# EAGLE design CoffretClimatique (EAGLE 6.4)
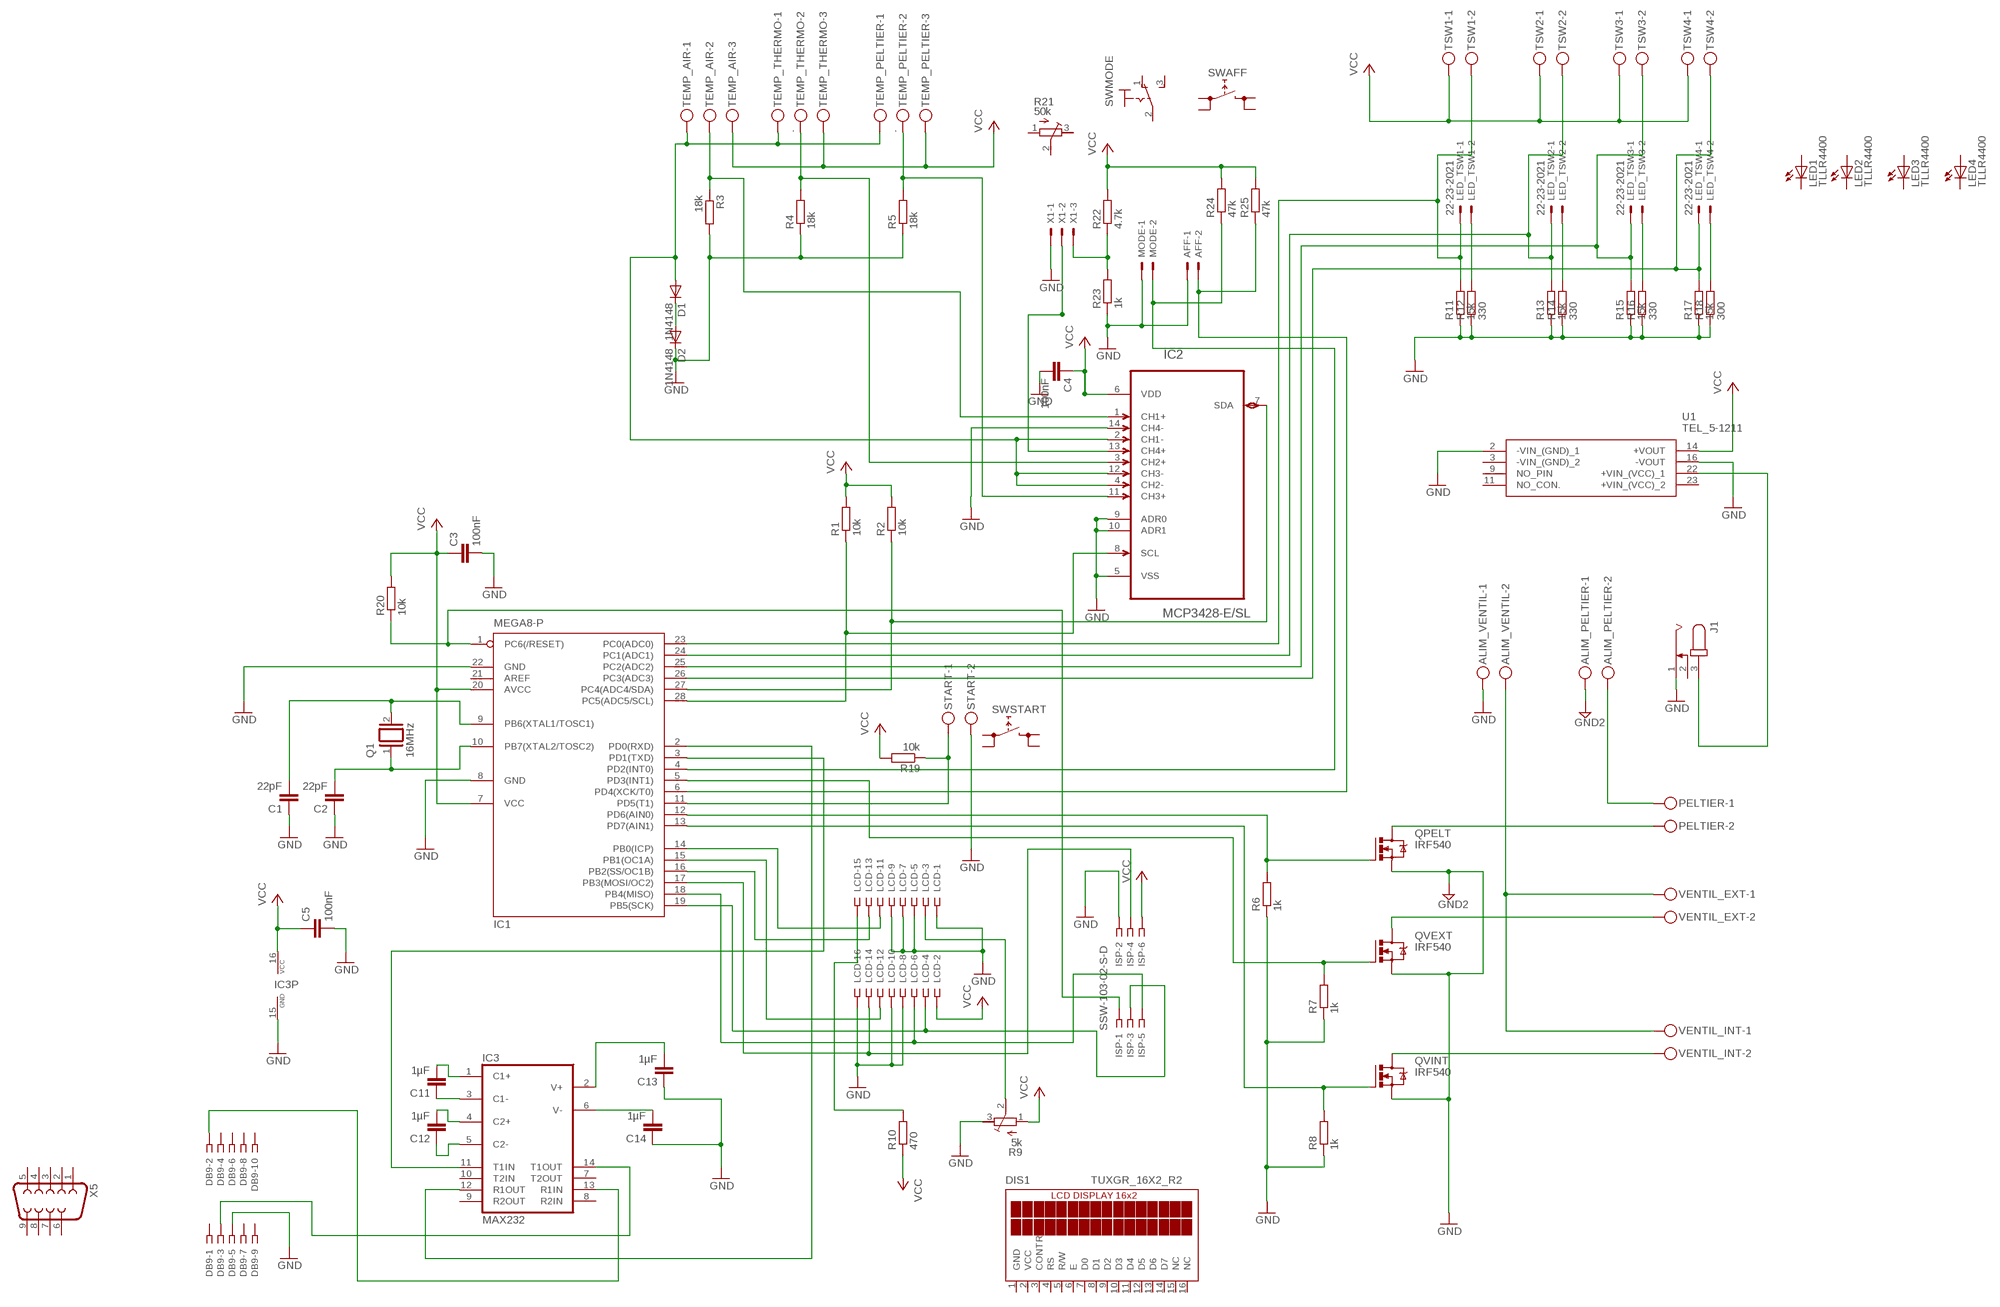
[diagram p0: schematic, sheet 1]

## Parts
AFF  22-23-2021  [22-23-2021]
ALIM_PELTIER  MKDSN1,5/2-5,08  [MKDSN1,5/2-5,08]
ALIM_VENTIL  MKDSN1,5/2-5,08  [MKDSN1,5/2-5,08]
C1  22pF  C-EU075-032X103  [C075-032X103]
C2  22pF  C-EU075-032X103  [C075-032X103]
C3  100nF  C-EUC1206  [C1206]
C4  100nF  C-EUC1206  [C1206]
C5  100nF  C-EUC1206  [C1206]
C11  1µF  C-EUC1206  [C1206]
C12  1µF  C-EUC1206  [C1206]
C13  1µF  C-EUC1206  [C1206]
C14  1µF  C-EUC1206  [C1206]
D1  1N4148  1N4148DO35-10  [DO35-10]
D2  1N4148  1N4148DO35-10  [DO35-10]
DB9  SSW-105-02-S-D  [SSW-105-02-S-D]
DIS1  TUXGR_16X2_R2  [TUXGR_16X2_R2]
IC1  MEGA8-P  [DIL28-3]
IC2  MCP3428-E/SL  [SOIC127P600X175-14N]
IC3  MAX232  [DIL16]
ISP  SSW-103-02-S-D  [SSW-103-02-S-D]
J1  JACK-PLUG1  [SPC4078]
LCD  SSW-108-02-S-D  [SSW-108-02-S-D]
LED1  TLLR4400  [LED3MM]
LED2  TLLR4400  [LED3MM]
LED3  TLLR4400  [LED3MM]
LED4  TLLR4400  [LED3MM]
LED_TSW1  22-23-2021  [22-23-2021]
LED_TSW2  22-23-2021  [22-23-2021]
LED_TSW3  22-23-2021  [22-23-2021]
LED_TSW4  22-23-2021  [22-23-2021]
MODE  22-23-2021  [22-23-2021]
PELTIER  MKDSN1,5/2-5,08  [MKDSN1,5/2-5,08]
Q1  16MHz  XTAL/S  [QS]
QPELT  IRF540  [TO220BV]
QVEXT  IRF540  [TO220BV]
QVINT  IRF540  [TO220BV]
R1  10k  R-EU_R0805  [R0805]
R2  10k  R-EU_R0805  [R0805]
R3  18k  R-EU_0207/10  [0207/10]
R4  18k  R-EU_0207/10  [0207/10]
R5  18k  R-EU_0207/10  [0207/10]
R6  1k  R-EU_0207/10  [0207/10]
R7  1k  R-EU_0207/10  [0207/10]
R8  1k  R-EU_0207/10  [0207/10]
R9  5k  R-TRIMM64P  [RTRIM64P]
R10  470  R-EU_0207/10  [0207/10]
R11  15k  R-EU_0207/10  [0207/10]
R12  330  R-EU_0207/10  [0207/10]
R13  15k  R-EU_0207/10  [0207/10]
R14  330  R-EU_0207/10  [0207/10]
R15  15k  R-EU_0207/10  [0207/10]
R16  330  R-EU_0207/10  [0207/10]
R17  15k  R-EU_0207/10  [0207/10]
R18  300  R-EU_0207/10  [0207/10]
R19  10k  R-EU_0207/10  [0207/10]
R20  10k  R-EU_0207/10  [0207/10]
R21  50k  R-TRIMM3296X  [RTRIM3296X]
R22  4.7k  R-EU_0207/10  [0207/10]
R23  1k  R-EU_0207/10  [0207/10]
R24  47k  R-EU_0207/10  [0207/10]
R25  47k  R-EU_0207/10  [0207/10]
START  MKDSN1,5/2-5,08  [MKDSN1,5/2-5,08]
SWAFF  REKN  [REKN]
SWMODE  M9040P  [M9040P]
SWSTART  REKN  [REKN]
TEMP_AIR  MKDSN1,5/3-5,08  [MKDSN1,5/3-5,08]
TEMP_PELTIER  .  MKDSN1,5/3-5,08  [MKDSN1,5/3-5,08]
TEMP_THERMO  .  MKDSN1,5/3-5,08  [MKDSN1,5/3-5,08]
TSW1  MKDSN1,5/2-5,08  [MKDSN1,5/2-5,08]
TSW2  MKDSN1,5/2-5,08  [MKDSN1,5/2-5,08]
TSW3  MKDSN1,5/2-5,08  [MKDSN1,5/2-5,08]
TSW4  MKDSN1,5/2-5,08  [MKDSN1,5/2-5,08]
U1  TEL_5-1211  [TEL-5-1211]
VENTIL_EXT  MKDSN1,5/2-5,08  [MKDSN1,5/2-5,08]
VENTIL_INT  MKDSN1,5/2-5,08  [MKDSN1,5/2-5,08]
X1  22-23-2031  [22-23-2031]
X5  F09V  [F09V]

## Nets
GND: AFF.1 ALIM_VENTIL.1 C1.1 C2.1 C3.2 C4.2 C5.2 C13.1 C14.1 D2.C DB9.5 IC1.8(GND) IC1.22(GND) IC2.5(VSS) IC2.9(ADR0) IC2.10(ADR1) IC2.14(CH4-) IC3.15(GND) ISP.2 J1.1 LCD.1 LCD.5 LCD.7 LCD.8 LCD.9 LCD.10 LCD.16 MODE.1 QPELT.S QVEXT.S QVINT.S R3.2 R4.1 R5.1 R6.1 R7.1 R8.1 R9.3(E) R11.1 R12.1 R13.1 R14.1 R15.1 R16.1 R17.1 R18.1 R23.1 START.2 U1.2(-VIN_(GND)_1) U1.16(-VOUT) X1.1 ; supply symbol labelled GND2
GND2 [PWR]: ALIM_PELTIER.1
N$1: C1.2 IC1.9(PB6(XTAL1/TOSC1)) Q1.2
N$2: C2.2 IC1.10(PB7(XTAL2/TOSC2)) Q1.1
N$3: J1.3 U1.22(+VIN_(VCC)_1)
N$4 [PWR]: QVEXT.D VENTIL_EXT.2
N$5: IC1.27(PC4(ADC4/SDA)) IC2.7(SDA) R2.1
N$6: IC1.28(PC5(ADC5/SCL)) IC2.8(SCL) R1.1
N$7: D1.C D2.A
N$8 [PWR]: ALIM_PELTIER.2 PELTIER.1
N$9: IC2.1(CH1+) R3.1 TEMP_AIR.2
N$10: IC2.3(CH2+) R4.2 TEMP_THERMO.2
N$11: IC2.11(CH3+) R5.2 TEMP_PELTIER.2
N$12: D1.A IC2.2(CH1-) IC2.4(CH2-) IC2.12(CH3-) TEMP_AIR.1 TEMP_PELTIER.1 TEMP_THERMO.1
N$13: IC2.13(CH4+) X1.2
N$14 [PWR]: PELTIER.2 QPELT.D
N$15: ALIM_VENTIL.2 VENTIL_EXT.1 VENTIL_INT.1
N$16: IC1.12(PD6(AIN0)) QPELT.G R6.2
N$17: IC1.5(PD3(INT1)) QVEXT.G R7.2
N$18: IC1.3(PD1(TXD)) IC3.11(T1IN)
N$19: QVINT.D VENTIL_INT.2
N$20: DB9.2 IC3.13(R1IN)
N$21: LCD.3 R9.2(S)
N$22: DB9.3 IC3.14(T1OUT)
N$23: LCD.15 R10.2
N$25: R22.1 R23.2 X1.3
N$30: IC1.4(PD2(INT0)) MODE.2 R24.1
N$31: AFF.2 IC1.6(PD4(XCK/T0)) R25.1
N$36: IC1.11(PD5(T1)) R19.1 START.1
N$37: IC1.2(PD0(RXD)) IC3.12(R1OUT)
N$38: IC1.13(PD7(AIN1)) QVINT.G R8.2
N$39: IC1.23(PC0(ADC0)) LED_TSW1.1 R11.2 TSW1.2
N$40: IC1.19(PB5(SCK)) ISP.3 LCD.4
N$41: IC1.24(PC1(ADC1)) LED_TSW2.1 R13.2 TSW2.2
N$42: IC1.18(PB4(MISO)) ISP.5 LCD.6
N$43: IC1.25(PC2(ADC2)) LED_TSW3.1 R15.2 TSW3.2
N$44: IC1.14(PB0(ICP)) LCD.11
N$45: IC1.26(PC3(ADC3)) LED_TSW4.1 R17.2 TSW4.2
N$46: IC1.15(PB1(OC1A)) LCD.12
N$47: IC1.16(PB2(SS/OC1B)) LCD.13
N$48: LED_TSW1.2 R12.2
N$49: LED_TSW2.2 R14.2
N$50: LED_TSW3.2 R16.2
N$51: LED_TSW4.2 R18.2
N$52: IC1.17(PB3(MOSI/OC2)) ISP.4 LCD.14
N$53: IC1.1(PC6(/RESET)) ISP.1 R20.1
N$54: C11.2 IC3.1(C1+)
N$55: C11.1 IC3.3(C1-)
N$56: C12.2 IC3.4(C2+)
N$57: C12.1 IC3.5(C2-)
N$58: C14.2 IC3.6(V-)
N$59: C13.2 IC3.2(V+)
VCC: C3.1 C4.1 C5.1 IC1.7(VCC) IC1.20(AVCC) IC2.6(VDD) IC3.16(VCC) ISP.6 LCD.2 R1.2 R2.2 R9.1(A) R10.1 R19.2 R20.2 R22.2 R24.2 R25.2 TEMP_AIR.3 TEMP_PELTIER.3 TEMP_THERMO.3 TSW1.1 TSW2.1 TSW3.1 TSW4.1 U1.14(+VOUT)
Unconnected: DB9.1 DB9.4 DB9.6 DB9.7 DB9.8 DB9.9 DB9.10 DIS1.3(CONTR) DIS1.4(RS) DIS1.5(R/W) DIS1.6(E) DIS1.7(D0) DIS1.8(D1) DIS1.9(D2) DIS1.10(D3) DIS1.11(D4) DIS1.12(D5) DIS1.13(D6) DIS1.14(D7) DIS1.15(NC) DIS1.16(NC) IC1.21(AREF) IC3.7(T2OUT) IC3.8(R2IN) IC3.9(R2OUT) IC3.10(T2IN) J1.2 LED1.A LED1.K(C) LED2.A LED2.K(C) LED3.A LED3.K(C) LED4.A LED4.K(C) R21.1(A) R21.2(S) R21.3(E) SWAFF.0A SWAFF.0B SWAFF.1A SWAFF.1B SWMODE.1(O) SWMODE.2(P) SWMODE.3(S) SWSTART.0A SWSTART.0B SWSTART.1A SWSTART.1B U1.3(-VIN_(GND)_2) U1.9(NO_PIN) U1.11(NO_CON.) U1.23(+VIN_(VCC)_2) X5.1 X5.2 X5.3 X5.4 X5.5 X5.6 X5.7 X5.8 X5.9

## Power pins joined to a net without a drawn wire
GND: DIS1.1(GND)
VCC: DIS1.2(VCC)

## Library data of the parts
AFF LED_TSW1-LED_TSW4 MODE = con-molex:22-23-2021: .100" (2.54mm) Center Header - 2 Pin; MF: MOLEX; MPN: 22-23-2021; OC_FARNELL: 1462926; OC_NEWARK: 25C3832
ALIM_PELTIER ALIM_VENTIL PELTIER START TSW1-TSW4 VENTIL_EXT VENTIL_INT = con-phoenix-508:MKDSN1,5/2-5,08: MKDSN 1,5/ 2-5,08 Printklemme Nennstrom: 13,5 A Nennspannung: 250 V Rastermaß: 5,08 mm Polzahl: 2 Anschlussart: Schraubanschluss Montage: Löten Anschlussrichtung Leiter/Platine: 0 ° Artikelnummer: 1729128 Source: http://eshop.phoenixcontact.com .. 1729128.pdf; MPN: MKDSN 1,5/2-5.08; OC_FARNELL: 1792903; OC_NEWARK: 30M2397
C1-C5 C11-C14 = rcl:C-EU: CAPACITOR, European symbol
D1 D2 = diode:1N4148: DIODE high speed (Philips)
DB9 = con-samtec:SSW-105-02-S-D: THROUGH-HOLE .025" SQ POST SOCKET Source: Samtec SSW.pdf; MPN: SSW-105-02-S-D; OC_FARNELL: unknown; OC_NEWARK: 11P9398
DIS1 = display-lcd:TUXGR_16X2_R2: Tuxgraphics LCD display 16x2 characters reflective, without background light Source: tuxgr_12x2_r2.pdf; OC_FARNELL: unknown; OC_NEWARK: unknown
IC1 = atmel:MEGA8-P: MICROCONTROLLER 8 Kbytes FLASH, 1 kbytes SRAM, 512 bytes EEPROM, USART, 4-channel 10 bit ADC, 2-channel 8 bit ADC Pin compatible with Atmega48, ATMega88, ATMega168 Source: avr.lbr; OC_FARNELL: unknown; OC_NEWARK: unknown
IC2 = Microchip_By_element14_Batch_1:MCP3428-E/SL: Analog-to-Digital Converter; MPN: MCP3428-E/SL; OC_FARNELL: 1825014; OC_NEWARK: 52R9962; PACKAGE: SOIC-14; SUPPLIER: Microchip
IC3 = maxim:MAX232: RS232 TRANSEIVER; MF: MAXIM; MPN: MAX232ACPE+; OC_FARNELL: 9723773; OC_NEWARK: 68K4544
ISP = con-samtec:SSW-103-02-S-D: THROUGH-HOLE .025" SQ POST SOCKET Source: Samtec SSW.pdf; MPN: SSW-103-02-S-D; OC_FARNELL: unknown; OC_NEWARK: 11P9365
J1 = con-jack:JACK-PLUG: DC POWER JACK Power Jack, DC, Right Angle, Through Hole, Rated 5A at 16VDC, PC Terminals Distributor: Farnell (www.Farnell.de) Drawing: 84N1161.pdf / 84N1162.pdf Manufacturer: SPC Technology (www.spctechnology.com) Type: SPC4077 / SPC 4078; OC_FARNELL: unknown; OC_NEWARK: unknown
LCD = con-samtec:SSW-108-02-S-D: THROUGH-HOLE .025" SQ POST SOCKET Source: Samtec SSW.pdf; MPN: SSW-108-02-S-D; OC_FARNELL: unknown; OC_NEWARK: 85K7646
LED1-LED4 = led:TLLR4400: Low Current (2mA) LED 3 mm Tinted Diffused Package color RED Source: Data sheet <http://www.farnell.com/datasheets/391100.pdf>; MF: VISHAY SEMICONDUCTOR; OC_FARNELL: 1612437
Q1 = special:XTAL/S: CRYSTAL
QPELT QVEXT QVINT = transistor-power:IRF540: HEXFET Power MOSFET
R1-R8 R10-R20 R22-R25 = rcl:R-EU_: RESISTOR, European symbol
R9 R21 = rcl:R-TRIMM: Trimm resistor
SWAFF SWSTART = switch:REKN: PUSH SWITCH ITT-Cannon-Cannon
SWMODE = switch:M9040P: TOGGLE SWITCH Marquardt
TEMP_AIR TEMP_PELTIER TEMP_THERMO = con-phoenix-508:MKDSN1,5/3-5,08: MKDSN 1,5/ 3-5,08 Printklemme Nennstrom: 13,5 A Nennspannung: 250 V Rastermaß: 5,08 mm Polzahl: 3 Anschlussart: Schraubanschluss Montage: Löten Anschlussrichtung Leiter/Platine: 0 ° Artikelnummer: 1729131 Source: http://eshop.phoenixcontact.com .. 1729131.pdf; MPN: SMKDSN1,5/3-5,08; OC_FARNELL: 1792904; OC_NEWARK: 70R0299
U1 = TEL_5-1211:TEL_5-1211: TEL5 DC-DC converter,9-18Vin 5V 5W TRACOPOWER Isolated DC-DC Converter, Vin 9 18 V dc, Vout 5V dc, I/O isolation 1500V dc Source: Datasheet <http://assets.tracopower.com/20170802134720/TEL5/documents/tel5-datasheet.pdf>; ALLIED_NUMBER: 70421183; ALLIED_PRICE-STOCK: https://www.alliedelec.com/tracopower-tel-5-1211/70421183/; DESCRIPTION: TEL5 DC-DC converter,9-18Vin 5V 5W TRACOPOWER Isolated DC-DC Converter, Vin 9 18 V dc, Vout 5V dc, I/O isolation 1500V dc; HEIGHT: mm; MANUFACTURER_NAME: Traco Power; MANUFACTURER_PART_NUMBER: TEL 5-1211; MOUSER_PART_NUMBER: 495-TEL-5-1211; MOUSER_PRICE-STOCK: https://www.mouser.com/Search/Refine.aspx?Keyword=495-TEL-5-1211; RS_PART_NUMBER: 4667051; RS_PRICE-STOCK: https://uk.rs-online.com/web/p/products/4667051
X1 = con-molex:22-23-2031: .100" (2.54mm) Center Header - 3 Pin; MF: MOLEX; MPN: 22-23-2031; OC_FARNELL: 1462950; OC_NEWARK: 30C0862
X5 = con-subd:F09: SUB-D; OC_FARNELL: unknown; OC_NEWARK: unknown

## Net classes
1 PWR: width 2 mm

## Board
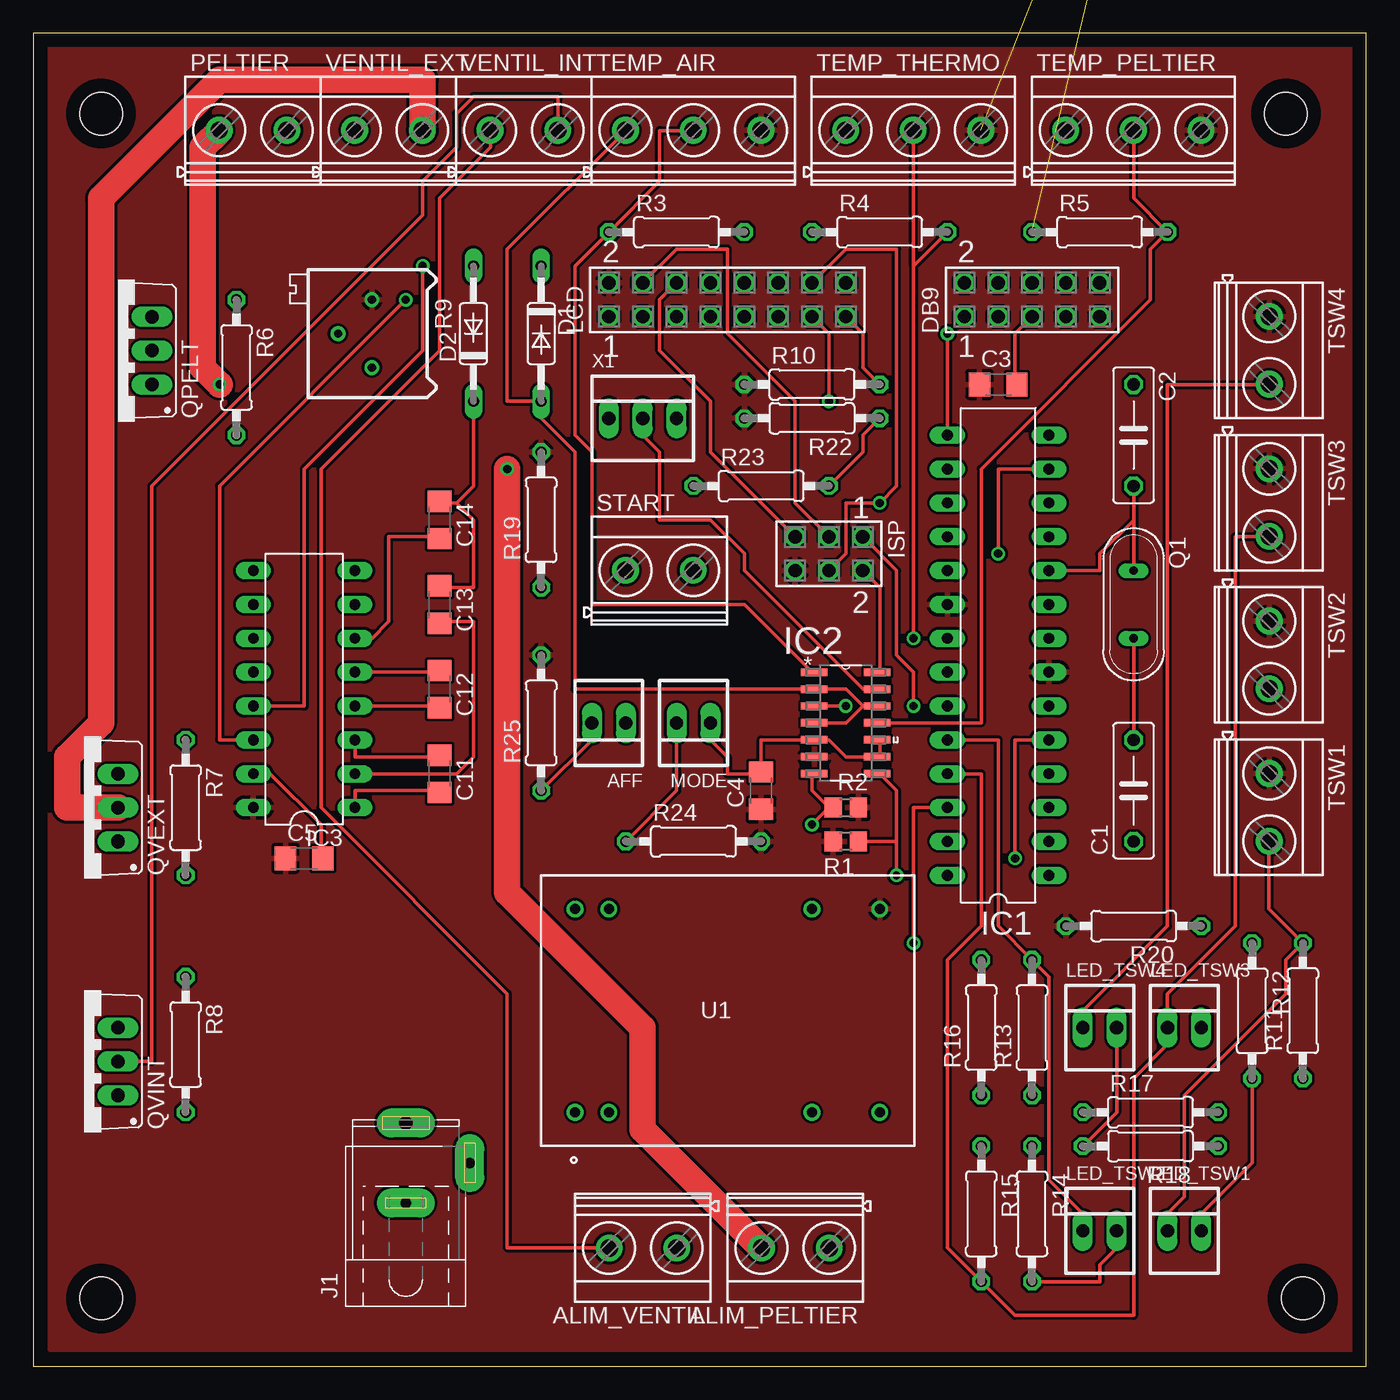
[diagram p1: board, top side]
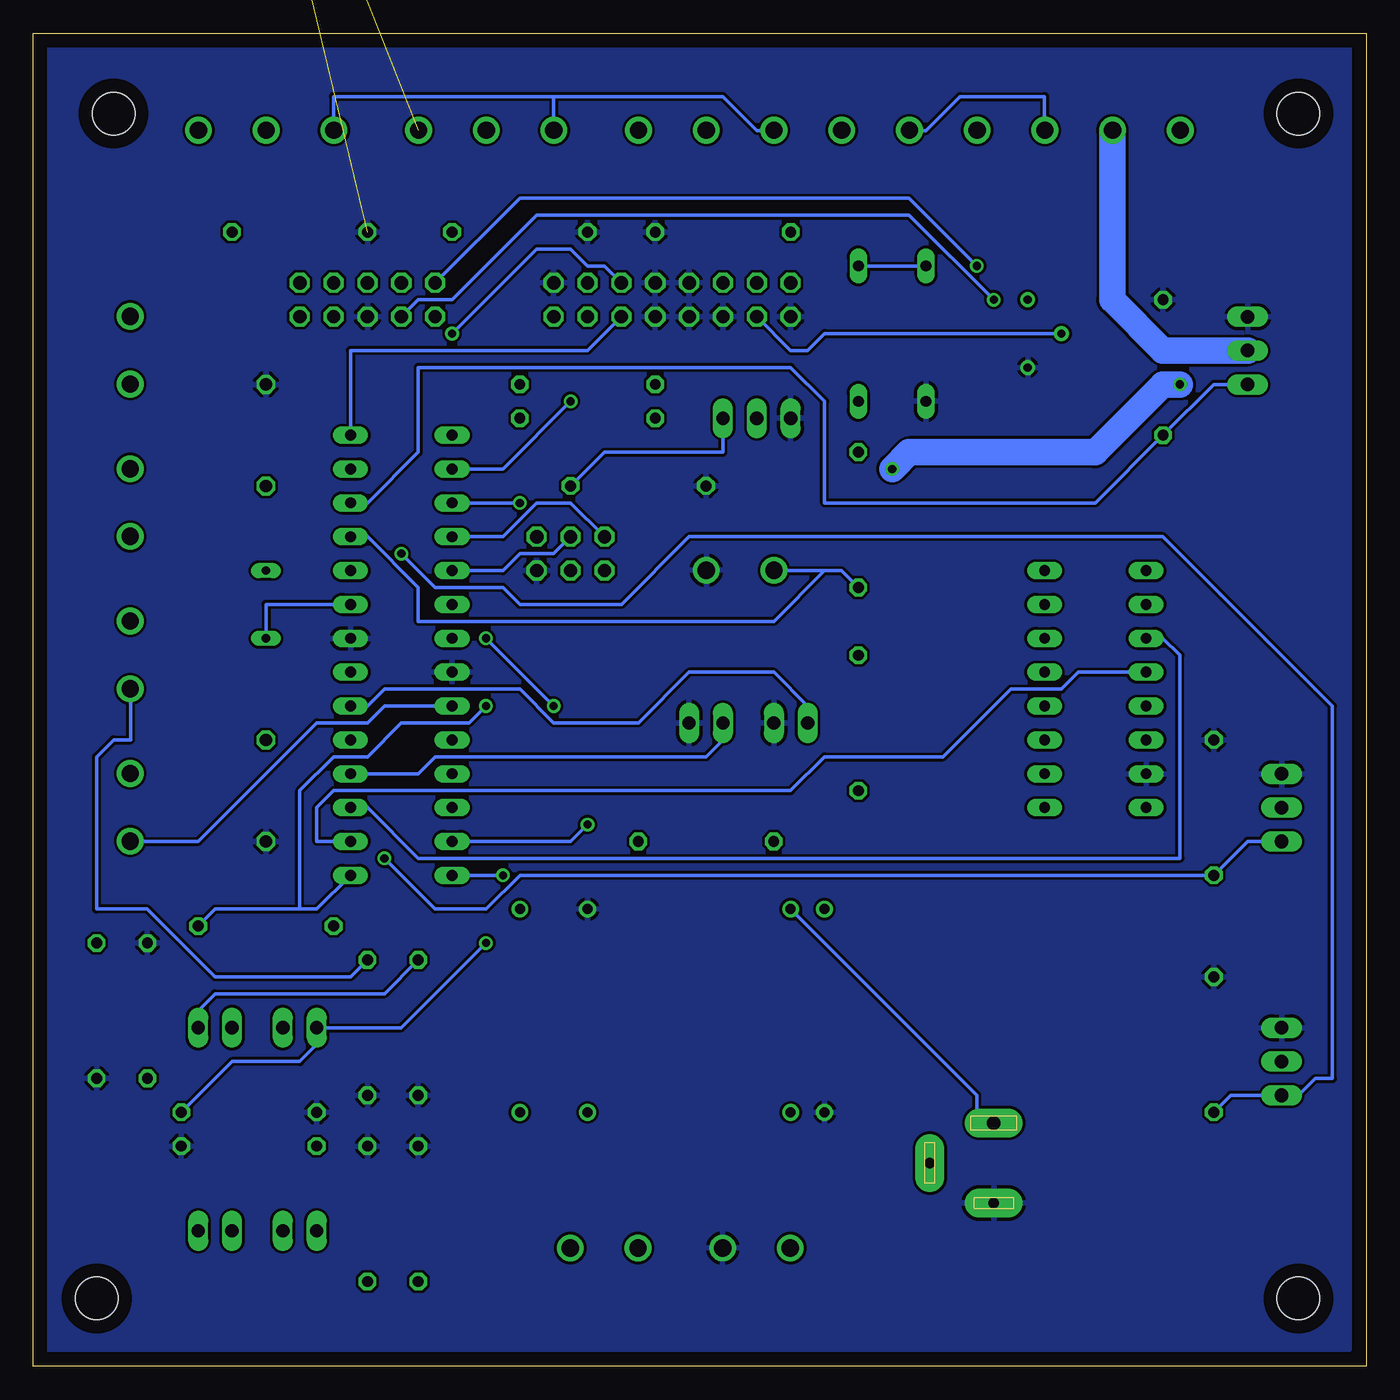
[diagram p2: board, bottom side, seen from below]

Size 100 x 100 mm. Coordinates in mm from the lower left corner, seen from the top.
Outline: 0,0 100,0 100,100 0,100 0,0
Copper layers (1*16): Top 0.035mm / dielectric 1.5mm / Bottom 0.035mm
Design rules "default": minimum track width 10mil, minimum drill 24mil, track to track 8mil, track to pad 8mil, pad to pad 8mil, via to via 8mil, smd to smd 8mil, copper to edge 40mil, drill to drill 8mil, minimum pad ring 10mil, minimum via ring 8mil, stop-mask expansion 4mil, vias tented up to drill 0mil, thermal gap 10mil
Holes 3.2 mm at 95.25,5.08 5.08,5.08 93.98,93.98 5.08,93.98

### Footprints (pad centres in the part's own frame; a part is rotated, then mirrored left to right if it is on the bottom)
22-23-2021 = drill 1 long: 1 -1.27,0; 2 1.27,0
MKDSN1,5/2-5,08 = drill 1.3 pad 2: 1 -2.561,0.025; 2 2.519,0.025
C075-032X103 = drill 0.914 octagon: 1 -3.81,0; 2 3.81,0
C1206 = smd 1.6 x 1.8: 1 -1.4,0; 2 1.4,0
DO35-10 = drill 0.813 long: A 5.08,0; C -5.08,0
SSW-105-02-S-D = drill 1 pad 1.5 octagon: 1 -5.08,-1.27; 2 -5.08,1.27; 3 -2.54,-1.27; 4 -2.54,1.27; 5 0,-1.27; 6 0,1.27; 7 2.54,-1.27; 8 2.54,1.27; 9 5.08,-1.27; 10 5.08,1.27
TUXGR_16X2_R2 = drill 1 pad 1.676: 1 -32,15.5; 2 -29.46,15.5; 3 -26.92,15.5; 4 -24.38,15.5; 5 -21.84,15.5; 6 -19.3,15.5; 7 -16.76,15.5; 8 -14.22,15.5; 9 -11.68,15.5; 10 -9.14,15.5; 11 -6.6,15.5; 12 -4.06,15.5; 13 -1.52,15.5; 14 1.02,15.5; 15 3.56,15.5; 16 6.1,15.5 | hole 2.5: -37.5,-15.5; 37.5,-15.5; -37.5,15.5; 37.5,15.5
DIL28-3 = drill 0.813 long: 1 -16.51,-3.81; 2 -13.97,-3.81; 3 -11.43,-3.81; 4 -8.89,-3.81; 5 -6.35,-3.81; 6 -3.81,-3.81; 7 -1.27,-3.81; 8 1.27,-3.81; 9 3.81,-3.81; 10 6.35,-3.81; 11 8.89,-3.81; 12 11.43,-3.81; 13 13.97,-3.81; 14 16.51,-3.81; 15 16.51,3.81; 16 13.97,3.81; 17 11.43,3.81; 18 8.89,3.81; 19 6.35,3.81; 20 3.81,3.81; 21 1.27,3.81; 22 -1.27,3.81; 23 -3.81,3.81; 24 -6.35,3.81; 25 -8.89,3.81; 26 -11.43,3.81; 27 -13.97,3.81; 28 -16.51,3.81
SOIC127P600X175-14N = smd 1.981 x 0.559: 1 -2.362,3.81; 2 -2.362,2.54; 3 -2.362,1.27; 4 -2.362,0; 5 -2.362,-1.27; 6 -2.362,-2.54; 7 -2.362,-3.81; 8 2.362,-3.81; 9 2.362,-2.54; 10 2.362,-1.27; 11 2.362,0; 12 2.362,1.27; 13 2.362,2.54; 14 2.362,3.81
DIL16 = drill 0.813 long: 1 -8.89,-3.81; 2 -6.35,-3.81; 3 -3.81,-3.81; 4 -1.27,-3.81; 5 1.27,-3.81; 6 3.81,-3.81; 7 6.35,-3.81; 8 8.89,-3.81; 9 8.89,3.81; 10 6.35,3.81; 11 3.81,3.81; 12 1.27,3.81; 13 -1.27,3.81; 14 -3.81,3.81; 15 -6.35,3.81; 16 -8.89,3.81
SSW-103-02-S-D = drill 1 pad 1.5 octagon: 1 -2.54,-1.27; 2 -2.54,1.27; 3 0,-1.27; 4 0,1.27; 5 2.54,-1.27; 6 2.54,1.27
SPC4078 = drill 0.8 pad 2.184 long: 1 -3,0; 2 0,-4.8 | drill 1 pad 2.184 long: 3 3,0
SSW-108-02-S-D = drill 1 pad 1.5 octagon: 1 -8.89,-1.27; 2 -8.89,1.27; 3 -6.35,-1.27; 4 -6.35,1.27; 5 -3.81,-1.27; 6 -3.81,1.27; 7 -1.27,-1.27; 8 -1.27,1.27; 9 1.27,-1.27; 10 1.27,1.27; 11 3.81,-1.27; 12 3.81,1.27; 13 6.35,-1.27; 14 6.35,1.27; 15 8.89,-1.27; 16 8.89,1.27
LED3MM = drill 0.813 octagon: A -1.27,0; K 1.27,0
QS = drill 0.61 long: 1 -2.54,0; 2 2.54,0
TO220BV = drill 1.016 long: D 0,-2.54; G -2.54,-2.54; S 2.54,-2.54
R0805 = smd 1.3 x 1.5: 1 -0.95,0; 2 0.95,0
0207/10 = drill 0.813 octagon: 1 -5.08,0; 2 5.08,0
RTRIM64P = drill 0.61: 1 0,-2.54; 2 2.54,0; 3 0,2.54
RTRIM3296X = drill 0.61: 1 0,-2.54; 2 0,0; 3 0,2.54
REKN = drill 0.9 long: 0A 5.08,5.08; 0B 5.08,-5.08; 1A 0,5.08; 1B 0,-5.08; A -5.08,5.08; B -5.08,-5.08 | hole 1.1: -5.08,0; 5.08,0
M9040P = drill 1.803 long: 1 0,4.699; 2 0,0; 3 0,-4.699
MKDSN1,5/3-5,08 = drill 1.3 pad 2: 1 -7.641,0.025; 2 -2.561,0.025; 3 2.519,0.025
TEL-5-1211 = drill 0.75 pad 1.25: 2 2.54,-7.62; 3 5.08,-7.62; 9 20.32,-7.62; 11 25.4,-7.62; 14 25.4,7.62; 16 20.32,7.62; 22 5.08,7.62; 23 2.54,7.62
22-23-2031 = drill 1 long: 1 -2.54,0; 2 0,0; 3 2.54,0
F09V = drill 1.016 octagon: 1 5.486,1.422; 2 2.743,1.422; 3 0,1.422; 4 -2.743,1.422; 5 -5.486,1.422; 6 4.115,-1.422; 7 1.372,-1.422; 8 -1.372,-1.422; 9 -4.115,-1.422 | hole 3.302: -12.522,0; 12.522,0

### Placement (x,y rotation side)
AFF  43.18,48.26 180 top
ALIM_PELTIER  57.15,8.89 180 top
ALIM_VENTIL  45.72,8.89 180 top
C1  82.55,43.18 90 top
C2  82.55,69.85 270 top
C3  72.39,73.66 0 top
C4  54.61,43.18 90 top
C5  20.32,38.1 0 top
C11  30.48,44.45 270 top
C12  30.48,50.8 270 top
C13  30.48,57.15 270 top
C14  30.48,63.5 270 top
D1  38.1,77.47 270 top
D2  33.02,77.47 90 top
DB9  74.93,80.01 0 top
DIS1  49.53,128.27 180 top  (outside the outline)
IC1  72.39,53.34 90 top
IC2  60.96,48.26 0 top
IC3  20.32,50.8 90 top
ISP  59.69,60.96 180 top
J1  27.94,15.24 90 top
LCD  52.07,80.01 0 top
LED1  20.32,209.55 90 top  (outside the outline)
LED2  25.4,209.55 90 top  (outside the outline)
LED3  30.48,209.55 90 top  (outside the outline)
LED4  35.56,209.55 90 top  (outside the outline)
LED_TSW1  86.36,10.16 0 top
LED_TSW2  80.01,10.16 0 top
LED_TSW3  86.36,25.4 0 top
LED_TSW4  80.01,25.4 0 top
MODE  49.53,48.26 180 top
PELTIER  16.51,92.71 0 top
Q1  82.55,57.15 270 top
QPELT  6.35,76.2 90 top
QVEXT  3.81,41.91 90 top
QVINT  3.81,22.86 90 top
R1  60.96,39.37 180 top
R2  60.96,41.91 0 top
R3  48.26,85.09 0 top
R4  63.5,85.09 0 top
R5  80.01,85.09 0 top
R6  15.24,74.93 270 top
R7  11.43,41.91 270 top
R8  11.43,24.13 270 top
R9  25.4,77.47 180 top
R10  58.42,73.66 0 top
R11  95.25,26.67 90 top
R12  91.44,26.67 270 top
R13  74.93,25.4 90 top
R14  74.93,11.43 270 top
R15  71.12,11.43 270 top
R16  71.12,25.4 90 top
R17  83.82,19.05 0 top
R18  83.82,16.51 180 top
R19  38.1,63.5 90 top
R20  82.55,33.02 180 top
R21  -10.16,198.12 0 top  (outside the outline)
R22  58.42,71.12 180 top
R23  54.61,66.04 0 top
R24  49.53,39.37 0 top
R25  38.1,48.26 90 top
START  46.99,59.69 0 top
SWAFF  35.56,189.23 0 top  (outside the outline)
SWMODE  -25.4,180.34 0 top  (outside the outline)
SWSTART  10.16,191.77 0 top  (outside the outline)
TEMP_AIR  52.07,92.71 0 top
TEMP_PELTIER  85.09,92.71 0 top
TEMP_THERMO  68.58,92.71 0 top
TSW1  92.71,41.91 270 top
TSW2  92.71,53.34 270 top
TSW3  92.71,64.77 270 top
TSW4  92.71,76.2 270 top
U1  38.1,26.67 0 top
VENTIL_EXT  26.67,92.71 0 top
VENTIL_INT  36.83,92.71 0 top
X1  45.72,71.12 0 top
X5  24.13,167.64 0 top  (outside the outline)

### Tracks (layer width: path | path; a pad name or v marks a point on that pad's centre or on a via)
GND  (1 unrouted)
  Top 0.254: 31.75,64.77 33.02,63.5 33.02,58.42 30.48,58.42 C13.1 | 31.75,64.77 30.48,64.77 C14.1 | IC2.10 63.5,46.99 63.5,45.72 IC2.9 60.96,45.72 59.69,46.99 IC2.5 58.42,46.99 54.61,46.99 C4.2 54.61,44.45 52.07,44.45 52.07,45.72 50.8,46.99 MODE.1 | IC3.15 17.78,44.45 21.59,40.64 21.59,38.1 C5.2 | DB9.5 73.66,77.47 73.66,73.66 C3.2 | ISP.2 63.5,58.42 63.5,52.07 IC2.14 | 31.75,64.77 33.02,66.04 D2.C
  pour Bottom: 1.27,99.06 99.06,99.06 99.06,1.27 1.27,1.27
N$1
  Top 0.254: Q1.2 C1.2
  Bottom 0.254: Q1.2 82.55,57.15 IC1.9
N$2
  Top 0.254: C2.2 82.55,63.5 | 82.55,63.5 Q1.1 | IC1.10 80.01,59.69 80.01,60.96 82.55,63.5
N$3
  Bottom 0.254: U1.22 29.21,20.32 29.21,19.05 27.94,19.05 J1.3
N$4
  Top 2: QVEXT.D 2.54,41.91 2.54,45.72 5.08,48.26 5.08,87.63 13.97,96.52 29.21,96.52 29.21,92.71 VENTIL_EXT.2
N$5  (via drill 0.61)
  Top 0.254: 59.69,41.91 58.42,43.18 58.42,44.45 IC2.7 | 59.69,41.91 v58.42,40.64 | 59.69,41.91 R2.1
  Bottom 0.254: IC1.27 59.69,39.37 v58.42,40.64
N$6  (via drill 0.61)
  Top 0.254: 64.77,39.37 R1.1 | 64.77,39.37 64.77,43.18 63.5,44.45 IC2.8 | 64.77,39.37 v64.77,36.83
  Bottom 0.254: v64.77,36.83 IC1.28
N$7
  Bottom 0.254: D1.C D2.A
N$8  (via drill 0.61)
  Top 2: v35.56,67.31 35.56,35.56 45.72,25.4 45.72,17.78 54.61,8.89 ALIM_PELTIER.2 | v13.97,73.66 12.7,74.93 12.7,91.44 13.97,92.71 PELTIER.1
  Bottom 2: v35.56,67.31 34.29,68.58 20.32,68.58 15.24,73.66 v13.97,73.66
N$9
  Top 0.254: IC2.1 58.42,52.07 53.34,57.15 41.91,57.15 41.91,68.58 40.64,69.85 40.64,82.55 R3.1 46.99,88.9 46.99,92.71 49.53,92.71 TEMP_AIR.2
N$10  (via drill 0.61)
  Top 0.254: v60.96,49.53 IC2.3 58.42,49.53 | 66.04,82.55 v66.04,54.61 | R4.2 66.04,82.55 | 66.04,82.55 66.04,92.71 TEMP_THERMO.2
  Bottom 0.254: v66.04,54.61 v60.96,49.53
N$11
  Top 0.254: IC2.11 71.12,48.26 71.12,67.31 83.82,80.01 83.82,83.82 R5.2 82.55,87.63 82.55,92.71 TEMP_PELTIER.2
N$12
  Top 0.254: 62.23,49.53 60.96,48.26 IC2.4 58.42,48.26 | 62.23,49.53 IC2.12 63.5,49.53 | 62.23,49.53 60.96,50.8 IC2.2 58.42,50.8 40.64,50.8 40.64,68.58 38.1,71.12 D1.A 35.56,72.39 35.56,83.82 44.45,92.71 TEMP_AIR.1
  Bottom 0.254: 60.96,95.25 60.96,92.71 TEMP_THERMO.1 | 60.96,95.25 48.26,95.25 45.72,92.71 44.45,92.71 TEMP_AIR.1 | 60.96,95.25 77.47,95.25 77.47,92.71 TEMP_PELTIER.1
N$13
  Top 0.254: X1.2 45.72,69.85 46.99,68.58 46.99,63.5 50.8,63.5 53.34,60.96 53.34,59.69 62.23,50.8 IC2.13 63.5,50.8
N$14
  Bottom 2: QPELT.D 15.24,76.2 19.05,80.01 19.05,92.71 PELTIER.2
N$15
  Top 0.254: ALIM_VENTIL.2 43.18,8.89 35.56,8.89 35.56,27.94 21.59,41.91 21.59,67.31 30.48,76.2 30.48,87.63 34.29,91.44 34.29,92.71 VENTIL_INT.1
  Bottom 0.254: VENTIL_EXT.1 24.13,92.71 24.13,95.25 30.48,95.25 33.02,92.71 34.29,92.71 VENTIL_INT.1
N$16
  Bottom 0.254: QPELT.G 11.43,73.66 R6.2 20.32,64.77 40.64,64.77 40.64,72.39 43.18,74.93 71.12,74.93 71.12,68.58 74.93,64.77 IC1.12
N$17  (via drill 0.61)
  Top 0.254: IC1.5 73.66,46.99 v73.66,38.1
  Bottom 0.254: QVEXT.G 8.89,39.37 R7.2 63.5,36.83 66.04,34.29 69.85,34.29 v73.66,38.1
N$18
  Bottom 0.254: IC3.11 15.24,54.61 13.97,53.34 13.97,38.1 71.12,38.1 74.93,41.91 IC1.3
N$19
  Top 0.254: QVINT.D 8.89,22.86 8.89,66.04 29.21,86.36 29.21,88.9 31.75,91.44 31.75,93.98 33.02,95.25 39.37,95.25 39.37,92.71 VENTIL_INT.2
N$20  (via drill 0.61)
  Top 0.254: IC3.13 20.32,49.53 20.32,67.31 29.21,76.2 v29.21,82.55
  Bottom 0.254: v29.21,82.55 34.29,87.63 63.5,87.63 DB9.2
N$21
  Bottom 0.254: R9.2 40.64,77.47 41.91,76.2 43.18,76.2 LCD.3
N$22  (via drill 0.61)
  Top 0.254: IC3.14 13.97,46.99 13.97,66.04 v27.94,80.01
  Bottom 0.254: v27.94,80.01 34.29,86.36 62.23,86.36 68.58,80.01 71.12,80.01 DB9.3
N$23
  Top 0.254: R10.2 62.23,74.93 62.23,77.47 LCD.15
N$25
  Top 0.254: R23.2 62.23,68.58 62.23,69.85 R22.1
  Bottom 0.254: X1.3 48.26,68.58 57.15,68.58 R23.2
N$30
  Top 0.254: R24.1 48.26,43.18 MODE.2
  Bottom 0.254: IC1.4 71.12,44.45 69.85,45.72 49.53,45.72 48.26,46.99 MODE.2
N$31
  Top 0.254: R25.1 41.91,46.99 AFF.2
  Bottom 0.254: IC1.6 74.93,49.53 73.66,50.8 63.5,50.8 60.96,48.26 54.61,48.26 50.8,52.07 44.45,52.07 41.91,49.53 AFF.2
N$36
  Bottom 0.254: R19.1 39.37,59.69 40.64,59.69 | 40.64,59.69 44.45,59.69 START.1 | IC1.11 74.93,62.23 71.12,58.42 71.12,55.88 44.45,55.88 40.64,59.69
N$37
  Bottom 0.254: IC3.12 21.59,52.07 22.86,50.8 26.67,50.8 31.75,45.72 40.64,45.72 43.18,43.18 77.47,43.18 78.74,41.91 78.74,39.37 IC1.2
N$38  (via drill 0.61)
  Top 0.254: IC1.13 72.39,67.31 v72.39,60.96
  Bottom 0.254: R8.2 10.16,20.32 QVINT.G 5.08,20.32 3.81,21.59 2.54,21.59 2.54,49.53 15.24,62.23 50.8,62.23 55.88,57.15 63.5,57.15 64.77,58.42 69.85,58.42 v72.39,60.96
N$39
  Top 0.254: TSW1.2 92.71,39.37 92.71,34.29 R11.2 93.98,30.48 93.98,27.94 86.36,20.32 86.36,12.7 85.09,11.43 LED_TSW1.1
  Bottom 0.254: IC1.23 73.66,49.53 74.93,48.26 78.74,48.26 87.63,39.37 92.71,39.37 TSW1.2
N$40
  Top 0.254: LCD.4 48.26,83.82 52.07,83.82 52.07,77.47 57.15,72.39 57.15,64.77 ISP.3
  Bottom 0.254: IC1.19 64.77,59.69 63.5,60.96 60.96,60.96 ISP.3
N$41
  Top 0.254: LED_TSW2.1 78.74,11.43 76.2,13.97 76.2,29.21 R13.2 72.39,33.02 72.39,46.99 IC1.24
  Bottom 0.254: R13.2 76.2,29.21 86.36,29.21 91.44,34.29 95.25,34.29 95.25,45.72 93.98,46.99 92.71,46.99 92.71,50.8 TSW2.2
N$42
  Top 0.254: LCD.6 46.99,80.01 46.99,76.2 50.8,72.39 50.8,68.58 ISP.5
  Bottom 0.254: IC1.18 64.77,62.23 62.23,64.77 59.69,64.77 ISP.5
N$43
  Top 0.254: IC1.25 71.12,44.45 71.12,33.02 68.58,30.48 68.58,8.89 R15.2 73.66,3.81 82.55,3.81 82.55,21.59 85.09,24.13 LED_TSW3.1 85.09,27.94 90.17,33.02 90.17,62.23 92.71,62.23 TSW3.2
N$44
  Bottom 0.254: IC1.14 76.2,76.2 58.42,76.2 LCD.11
N$45  (via drill 0.61)
  Top 0.254: IC1.26 66.04,41.91 v66.04,31.75 | LED_TSW4.1 78.74,26.67 85.09,33.02 85.09,73.66 92.71,73.66 TSW4.2
  Bottom 0.254: R17.2 85.09,22.86 80.01,22.86 78.74,24.13 LED_TSW4.1 72.39,25.4 v66.04,31.75
N$46  (via drill 0.61)
  Top 0.254: v68.58,77.47 IC1.15
  Bottom 0.254: v68.58,77.47 62.23,83.82 59.69,83.82 58.42,82.55 57.15,82.55 LCD.12
N$47  (via drill 0.61)
  Top 0.254: v59.69,72.39 59.69,77.47 LCD.13
  Bottom 0.254: IC1.16 64.77,67.31 v59.69,72.39
N$48
  Top 0.254: R12.2 91.44,15.24 87.63,11.43 LED_TSW1.2
N$49
  Top 0.254: R14.2 80.01,6.35 80.01,7.62 81.28,8.89 LED_TSW2.2
N$50
  Bottom 0.254: R16.2 73.66,27.94 86.36,27.94 87.63,26.67 LED_TSW3.2
N$51
  Top 0.254: R18.2 81.28,19.05 LED_TSW4.2
N$52  (via drill 0.61)
  Top 0.254: ISP.4 60.96,60.96 60.96,64.77 v63.5,64.77 64.77,66.04 64.77,83.82 60.96,83.82 LCD.14
  Bottom 0.254: v63.5,64.77 IC1.17
N$53  (via drill 0.61)
  Top 0.254: ISP.1 64.77,59.69 64.77,53.34 66.04,52.07 v66.04,49.53
  Bottom 0.254: IC1.1 78.74,34.29 80.01,34.29 | 80.01,34.29 86.36,34.29 R20.1 | v66.04,49.53 67.31,48.26 72.39,48.26 74.93,45.72 77.47,45.72 80.01,43.18 80.01,34.29
N$54
  Top 0.254: IC3.1 24.13,43.18 30.48,43.18 C11.2
N$55
  Top 0.254: IC3.3 24.13,45.72 30.48,45.72 C11.1
N$56
  Top 0.254: IC3.4 30.48,49.53 C12.2
N$57
  Top 0.254: IC3.5 30.48,52.07 C12.1
N$58
  Top 0.254: IC3.6 25.4,54.61 26.67,55.88 26.67,62.23 30.48,62.23 C14.2
N$59
  Top 0.254: IC3.2 31.75,44.45 33.02,45.72 33.02,55.88 30.48,55.88 C13.2
VCC  (1 unrouted)
  pour Top: 1.27,99.06 99.06,99.06 99.06,1.27 1.27,1.27

### Text on the board
Document: +++ | --- | +++ | --- | +++ | --- | GND | VCC | GND | VCC | GND | VCC | GND | GND